# EAGLE design lpcprogger (EAGLE 5.00)
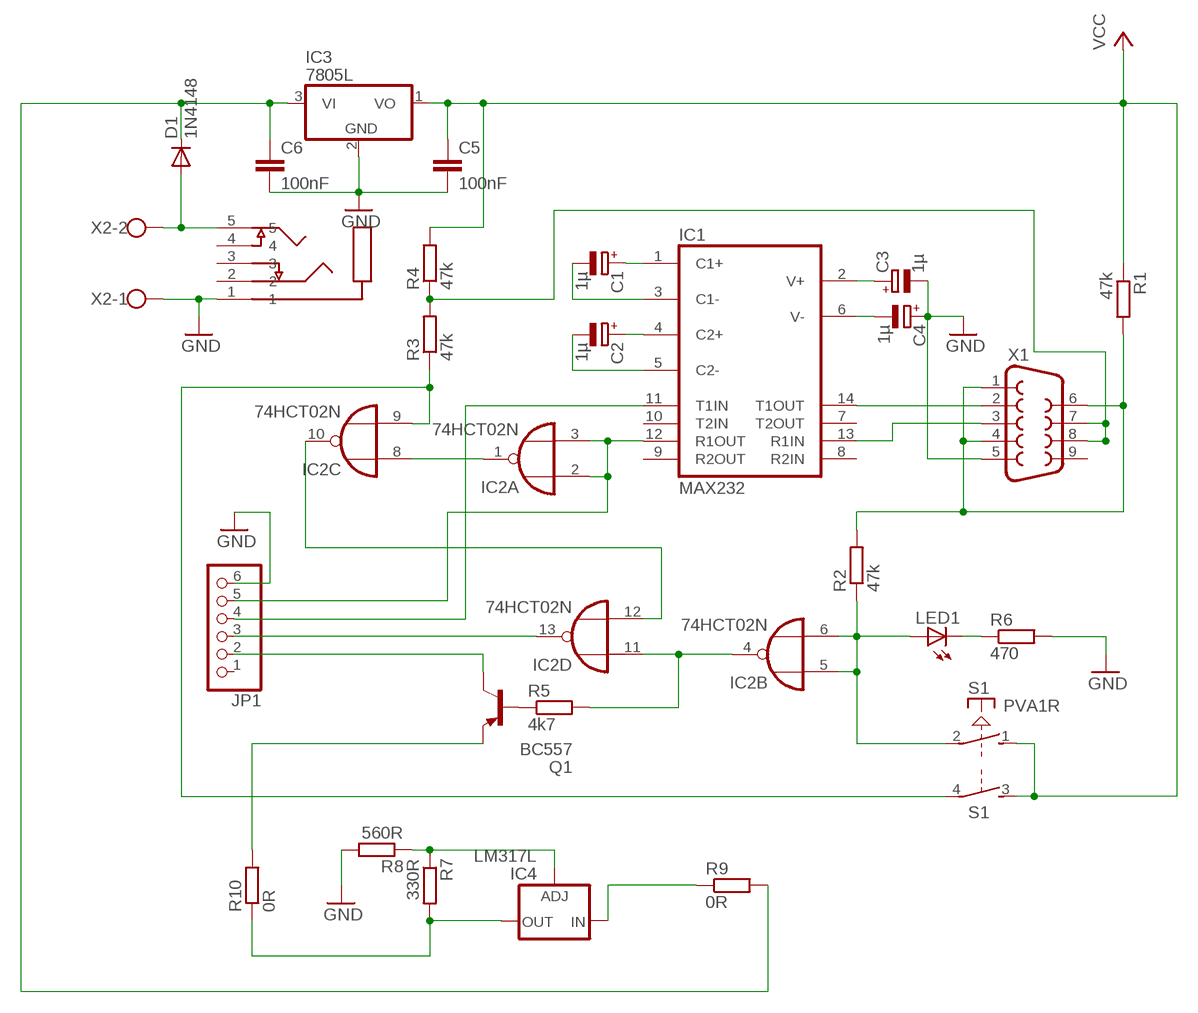
[diagram p0: schematic, sheet 1]

## Parts
C1  1µ  CPOL-EUE2.5-6  [E2,5-6]
C2  1µ  CPOL-EUE2.5-6  [E2,5-6]
C3  1µ  CPOL-EUE2.5-6  [E2,5-6]
C4  1µ  CPOL-EUE2.5-6  [E2,5-6]
C5  100nF  C-EU025-025X050  [C025-025X050]
C6  100nF  C-EU025-025X050  [C025-025X050]
D1  1N4148  [DO35-10]
IC1  MAX232  [DIL16]
IC2  74HCT02N  [DIL14]
IC3  7805L  [TO92]
IC4  LM317L  [317L]
JP1  PINHD-1X6  [1X06]
LED1  LED3MM  [LED3MM]
Q1  BC557  [TO92]
R1  47k  R-EU_0207/10  [0207/10]
R2  47k  R-EU_0207/10  [0207/10]
R3  47k  R-EU_0207/10  [0207/10]
R4  47k  R-EU_0207/10  [0207/10]
R5  4k7  R-EU_0207/10  [0207/10]
R6  470  R-EU_0207/10  [0207/10]
R7  330R  R-EU_0207/7  [0207/7]
R8  560R  R-EU_0207/7  [0207/7]
R9  0R  R-EU_0207/10  [0207/10]
R10  0R  R-EU_0207/10  [0207/10]
S1  PVA1R  [PVA1R]
U$1  KLINKENBUCHSE3,5MMSTEREO  [KLINKE3,5MMSTEREO]
X1  F09H  [F09H]
X2  W237-02P  [W237-132]

## Nets
GND: C3.- C4.+ C5.2 C6.2 IC3.2(GND) JP1.6 R6.2 R8.2 U$1.1 X1.5 X2.1
N$1: Q1.1(E) R10.2
N$2: IC1.14(T1OUT) X1.2
N$3: IC1.13(R1IN) X1.3
N$4: C1.+ IC1.1(C1+)
N$5: C1.- IC1.3(C1-)
N$6: C2.+ IC1.4(C2+)
N$7: C2.- IC1.5(C2-)
N$8: C3.+ IC1.2(V+)
N$9: C4.- IC1.6(V-)
N$11: IC2.5(B:I0) IC2.6(B:I1) LED1.A R2.1 S1.2(1:P)
N$12: IC2.4(B:O) IC2.11(D:I0) R5.2
N$13: IC1.12(R1OUT) IC2.2(A:I0) IC2.3(A:I1) JP1.5
N$14: IC2.1(A:O) IC2.8(C:I0)
N$15: R3.2 R4.1 X1.7 X1.8
N$16: IC2.9(C:I1) R3.1 S1.4(2:P)
N$17: IC2.10(C:O) IC2.12(D:I1)
N$18: IC2.13(D:O) JP1.3
N$19: LED1.K(C) R6.1
N$20: Q1.2(B) R5.1
N$21: IC4.3(IN) R9.1
N$22: JP1.2 Q1.3(C)
N$23: IC1.11(T1IN) JP1.4
N$24: R1.2 R2.2 X1.1 X1.4 X1.6
N$26: IC4.1(ADJ) R7.1 R8.1
N$27: IC4.2(OUT) R7.2 R10.1
N$28: D1.A U$1.5 X2.2
VCC: C5.1 IC3.1(VO) R1.1 R4.2 S1.1(1:S) S1.3(2:S)
VDD: C6.1 D1.C IC3.3(VI) R9.2
Unconnected: IC1.7(T2OUT) IC1.8(R2IN) IC1.9(R2OUT) IC1.10(T2IN) JP1.1 U$1.2 U$1.3 U$1.4 X1.9

## Power pins joined to a net without a drawn wire
GND: IC1.15(GND) IC2.7(P:GND)
VCC: IC1.16(VCC) IC2.14(P:VCC)

## Library data of the parts
C1-C4 = rcl:CPOL-EU: POLARIZED CAPACITOR, European symbol
C5 C6 = rcl:C-EU: CAPACITOR, European symbol
D1 = diode:1N4148: DIODE high speed (Philips)
IC1 = maxim:MAX232: RS232 TRANSEIVER
IC2 = 74xx-eu:74*02: Quad 2-input NOR gate
IC3 = linear:78*: Positive VOLTAGE REGULATOR Source: http://cache.national.com/ds/LM/LM78L05.pdf http://www.fairchildsemi.com/ds/LM/LM7805.pdf
IC4 = v-reg:LM317L: VOLTAGE REGULATOR
JP1 = pinhead:PINHD-1X6: PIN HEADER
LED1 = led:LED: LED OSRAM: - CHIPLED LG R971, LG N971, LY N971, LG Q971, LY Q971, LO R971, LY R971 LH N974, LH R974 LS Q976, LO Q976, LY Q976 LO Q996 - Hyper CHIPLED LW Q18S LB Q993, LB Q99A, LB R99A - SideLED LS A670, LO A670, LY A670, LG A670, LP A670 LB A673, LV A673, LT A673, LW A673 LH A674 LY A675 LS A676, LA A676, LO A676, LY A676, LW A676 LS A679, LY A679, LG A679 - Hyper Micro SIDELED® LS Y876, LA Y876, LO Y876, LY Y876 LT Y87S - SmartLED LW L88C, LW L88S LB L89C, LB L89S, LG L890 LS L89K, LO L89K, LY L89K LS L896, LA L896, LO L896, LY L896 - TOPLED LS T670, LO T670, LY T670, LG T670, LP T670 LSG T670, LSP T670, LSY T670, LOP T670, LYG T670 LG T671, LOG T671, LSG T671 LB T673, LV T673, LT T673, LW T673 LH T674 LS T676, LA T676, LO T676, LY T676, LB T676, LH T676, LSB T676, LW T676 LB T67C, LV T67C, LT T67C, LS T67K, LO T67K, LY T67K, LW E67C LS E67B, LA E67B, LO E67B, LY E67B, LB E67C, LV E67C, LT E67C LW T67C LS T679, LY T679, LG T679 LS T770, LO T770, LY T770, LG T770, LP T770 LB T773, LV T773, LT T773, LW T773 LH T774 LS E675, LA E675, LY E675, LS T675 LS T776, LA T776, LO T776, LY T776, LB T776 LHGB T686 LT T68C, LB T68C - Hyper Mini TOPLED® LB M676 - Mini TOPLED Santana® LG M470 LS M47K, LO M47K, LY M47K Source: http://www.osram.convergy.de - LUMILED® LXK2-PW12-R00, LXK2-PW12-S00, LXK2-PW14-U00, LXK2-PW14-V00 LXK2-PM12-R00, LXK2-PM12-S00, LXK2-PM14-U00 LXK2-PE12-Q00, LXK2-PE12-R00, LXK2-PE12-S00, LXK2-PE14-T00, LXK2-PE14-U00 LXK2-PB12-K00, LXK2-PB12-L00, LXK2-PB12-M00, LXK2-PB14-N00, LXK2-PB14-P00, LXK2-PB14-Q00 LXK2-PR12-L00, LXK2-PR12-M00, LXK2-PR14-Q00, LXK2-PR14-R00 LXK2-PD12-Q00, LXK2-PD12-R00, LXK2-PD12-S00 LXK2-PH12-R00, LXK2-PH12-S00 LXK2-PL12-P00, LXK2-PL12-Q00, LXK2-PL12-R00 Source: www.luxeon.com
Q1 = transistor-pnp:BC557: PNP Transistor
R1-R10 = rcl:R-EU_: RESISTOR, European symbol
S1 = switch-misc:PVA1R: ITT SWITCH
U$1 = kubi:KLINKENBUCHSE3,5MMSTEREO
X1 = con-subd:F09: SUB-D
X2 = con-wago-508:W237-02P: WAGO SREW CLAMP

## Board
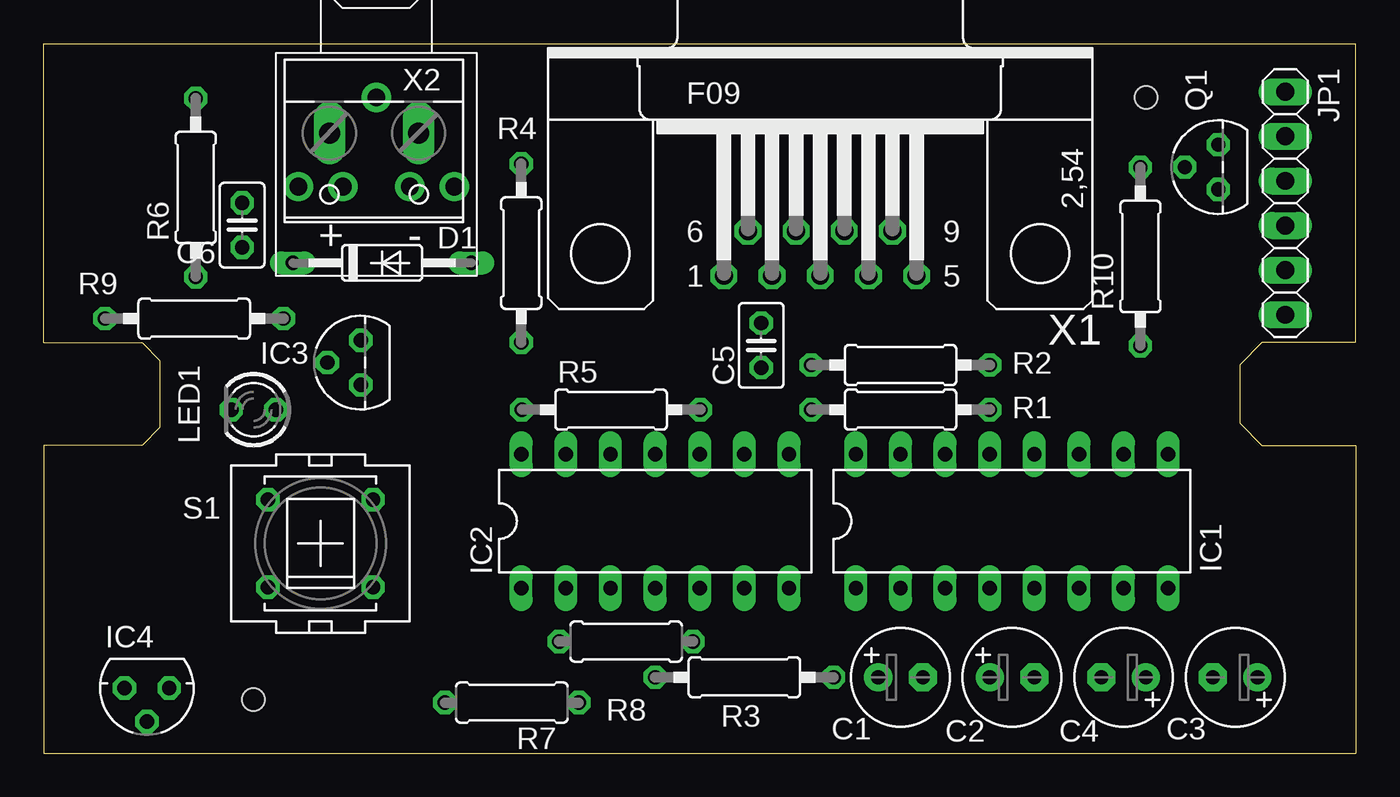
[diagram p1: board, top side]
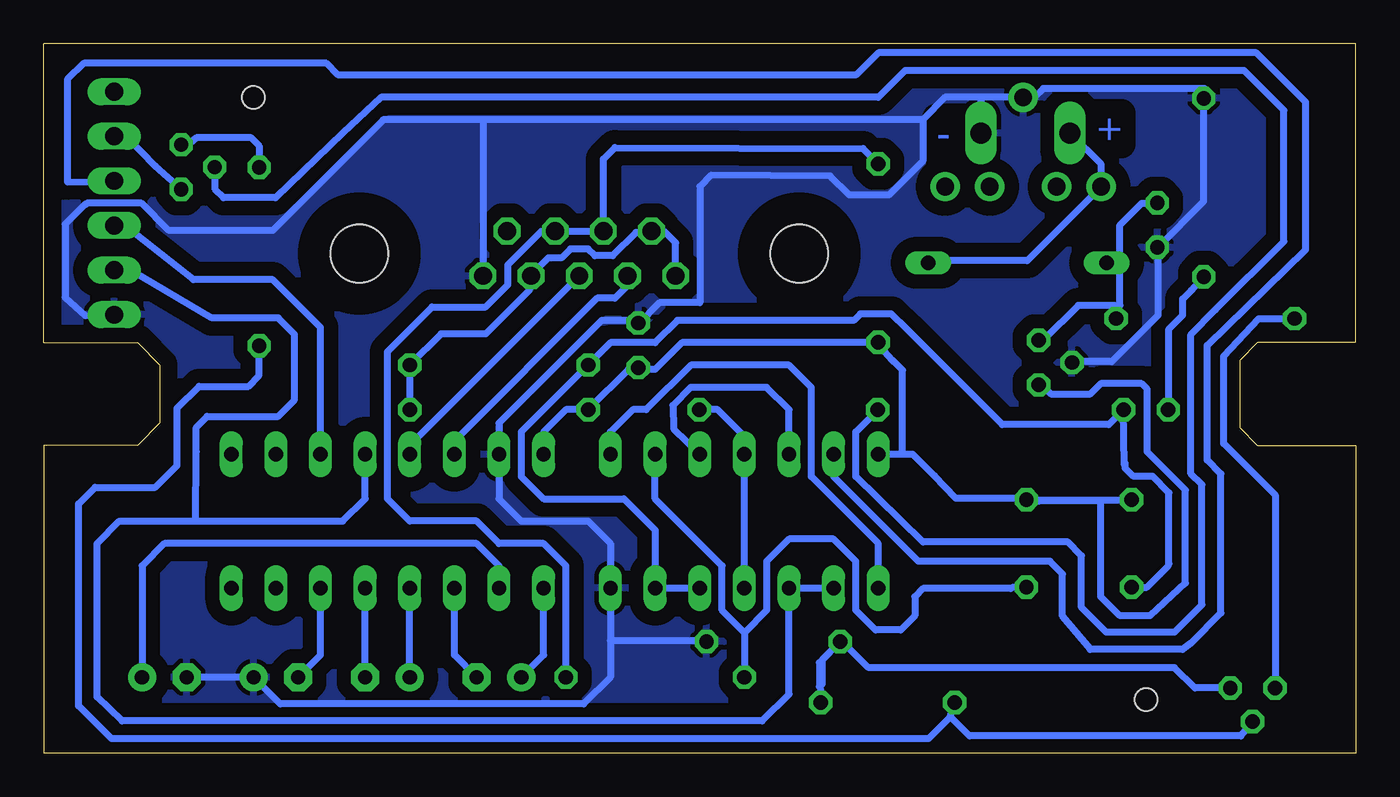
[diagram p2: board, bottom side, seen from below]

Size 74.68 x 40.39 mm. Coordinates in mm from the lower left corner, seen from the top.
Outline: 5.59,23.37 6.6,22.35 6.6,18.54 5.59,17.53 0,17.53 0,0 74.68,0 74.68,17.53 69.34,17.53 68.07,18.8 68.07,22.1 69.34,23.37 74.68,23.37 74.68,40.39 0,40.39 0,23.37 5.59,23.37
Copper layers (1*16): Top 0.035mm / dielectric 1.5mm / Bottom 0.035mm
Design rules "default": minimum track width 10mil, minimum drill 24mil, track to track 8mil, track to pad 8mil, pad to pad 8mil, via to via 8mil, smd to smd 8mil, copper to edge 40mil, drill to drill 8mil, minimum pad ring 10mil, minimum via ring 8mil, stop-mask expansion 4mil, vias tented up to drill 0mil, thermal gap 10mil
Holes 1.3 mm at 62.74,37.34 11.94,3.05

### Footprints (pad centres in the part's own frame; a part is rotated, then mirrored left to right if it is on the bottom)
E2,5-6 = drill 0.813 pad 1.6 round: + -1.27,0 | drill 0.813 pad 1.6 octagon: - 1.27,0
C025-025X050 = drill 0.813 octagon: 1 -1.27,0; 2 1.27,0
DO35-10 = drill 0.813 long: A 5.08,0; C -5.08,0
DIL16 = drill 0.813 long: 1 -8.89,-3.81; 2 -6.35,-3.81; 3 -3.81,-3.81; 4 -1.27,-3.81; 5 1.27,-3.81; 6 3.81,-3.81; 7 6.35,-3.81; 8 8.89,-3.81; 9 8.89,3.81; 10 6.35,3.81; 11 3.81,3.81; 12 1.27,3.81; 13 -1.27,3.81; 14 -3.81,3.81; 15 -6.35,3.81; 16 -8.89,3.81
DIL14 = drill 0.813 long: 1 -7.62,-3.81; 2 -5.08,-3.81; 3 -2.54,-3.81; 4 0,-3.81; 5 2.54,-3.81; 6 5.08,-3.81; 7 7.62,-3.81; 8 7.62,3.81; 9 5.08,3.81; 10 2.54,3.81; 11 0,3.81; 12 -2.54,3.81; 13 -5.08,3.81; 14 -7.62,3.81
TO92 = drill 0.813 octagon: 1 -1.27,0; 2 0,1.905; 3 1.27,0
317L = drill 0.813 octagon: 1 -1.27,0; 2 0,1.905; 3 1.27,0
1X06 = drill 1.016 long: 1 -6.35,0; 2 -3.81,0; 3 -1.27,0; 4 1.27,0; 5 3.81,0; 6 6.35,0
LED3MM = drill 0.813 octagon: A -1.27,0; K 1.27,0
TO92' = drill 0.813 octagon: 1 1.27,0; 2 0,1.905; 3 -1.27,0
0207/10 = drill 0.813 octagon: 1 -5.08,0; 2 5.08,0
0207/7 = drill 0.813 octagon: 1 -3.81,0; 2 3.81,0
PVA1R = drill 0.813 octagon: 1 -2.997,2.489; 2 -2.997,-2.489; 3 2.997,2.489; 4 2.997,-2.489
KLINKE3,5MMSTEREO = drill 1 pad 1.676 round: 1 2.54,5.715; 2 7.62,10.16; 3 7.62,7.62; 4 7.62,3.81; 5 7.62,1.27
F09H = drill 1.016 octagon: 1 -5.486,-1.27; 2 -2.743,-1.27; 3 0,-1.27; 4 2.743,-1.27; 5 5.486,-1.27; 6 -4.115,1.27; 7 -1.372,1.27; 8 1.372,1.27; 9 4.115,1.27 | hole 3.302: -12.522,0; 12.522,0
W237-132 = drill 1.194 long: 1 -2.54,-0.635; 2 2.54,-0.635

### Placement (x,y rotation side)
C1  48.77,4.32 0 top
C2  55.12,4.32 0 top
C3  67.82,4.32 180 top
C4  61.47,4.32 180 top
C5  40.84,23.22 90 top
C6  11.28,30.07 270 top
D1  19.25,27.92 0 top
IC1  55.12,13.21 0 top
IC2  34.8,13.21 0 top
IC3  18.04,22.24 90 top
IC4  5.86,3.71 180 top
JP1  70.67,31.31 270 top
LED1  11.94,19.56 180 top
Q1  BC557  [TO92']  66.86,33.37 90 top
R1  48.77,19.56 0 top
R2  48.77,22.1 0 top
R3  39.88,4.32 0 top
R4  27.18,28.47 270 top
R5  32.29,19.56 0 top
R6  8.65,32.21 90 top
R7  26.64,2.88 180 top
R8  33.15,6.35 0 top
R9  8.56,24.74 0 top
R10  62.42,28.28 90 top
S1  15.75,11.94 0 top
U$1  13.21,39.88 270 top
X1  44.2,28.45 0 top
X2  18.8,34.67 180 top

### Tracks (layer width: path | path; a pad name or v marks a point on that pad's centre or on a via)
GND
  Bottom 0.406: C3.- C4.+ 61.21,2.79 43.94,2.79 42.42,4.32 42.42,6.42 | 42.42,6.42 IC2.7 42.42,11.94 43.69,13.21 47.5,13.21 48.77,14.48 IC1.15 48.77,18.8 42.93,24.64 40.99,24.64 C5.2 40.89,24.43 40.89,24.38 39.62,25.65 37.34,25.65 37.34,32.26 36.69,32.91 29.91,32.87 28.82,31.78 26.57,31.78 24.64,33.71 24.64,36.07 | JP1.6 72.32,24.9 73.46,25.95 73.46,30.11 72.32,31.25 72.28,31.25 72.23,31.31 69.12,31.31 67.56,29.76 61.65,29.76 55.37,36.03 55.37,36.07 49.78,36.07 | 24.64,36.07 49.78,36.07 | 19.56,37.34 18.29,37.34 17.78,37.85 8.6,37.85 8.66,37.6 R6.2 8.64,31.42 11.24,28.82 | 19.56,37.34 U$1.1 | 24.64,36.07 23.37,37.34 21.34,37.34 | 19.56,37.34 21.34,37.34 | X1.5 49.68,35.97 49.78,36.07 | IC3.2 15.63,22.29 13.89,22.29 11.24,24.93 11.24,28.82 | 21.34,37.34 X2.1 | R8.2 37.03,6.42 42.42,6.42 | 11.24,28.82 11.27,28.8 C6.2
  pour Bottom (isolate 0.813): -1.98,42.05 -0.43,43.6 76.12,43.6 77.05,42.67 77.05,-2.45 76.9,-2.29 -1.2,-2.29
N$1
  Bottom 0.406: Q1.1 66.94,34.26 66,35.05 62.87,35.05 62.43,34.58 R10.2 | 62.43,33.33 R10.2 | R10.2
N$2
  Bottom 0.406: IC1.14 51.31,17.78 43.18,25.91 42.16,25.91 41.4,26.67 41.4,27.18 X1.2
N$3
  Bottom 0.406: IC1.13 53.85,17.53 X1.3
N$4
  Bottom 0.406: C1.+ 46.23,5.59 IC1.1
N$5
  Bottom 0.406: C1.- 51.31,5.59 IC1.3
N$6
  Bottom 0.406: C2.+ IC1.4
N$7
  Bottom 0.406: C2.- IC1.5
N$8
  Bottom 0.406: IC1.2 48.77,10.67 50.04,11.94 67.82,11.94 69.09,10.67 C3.+
N$9
  Bottom 0.406: C4.- 58.93,5.59 IC1.6
N$11
  Bottom 0.406: IC2.5 IC2.6 39.88,12.7 41.66,14.48 46.23,14.48 47.5,15.75 47.5,18.29 R2.1 42.42,23.37 39.88,23.37 38.61,24.64 28.57,24.64 28.19,25.02 26.43,25.02 25.56,24.15 | S1.2 11.89,9.45 10.67,10.67 10.62,10.78 10.62,14.82 11.55,15.75 12.64,15.75 13.11,16.22 13.11,16.5 13.16,16.4 LED1.A 14.05,18.71 20.11,18.71 25.56,24.15 | 25.56,24.15
N$12
  Bottom 0.406: IC2.4 IC2.11 34.8,18.03 36.32,19.56 R5.2
N$13
  Bottom 0.406: JP1.5 69.65,27.45 65.12,24.78 61.34,24.78 60.4,23.84 60.4,20.11 61.34,19.18 65.38,19.18 66,18.55 66,17.15 66.04,13.21 | IC2.2 IC2.3 32.26,3.36 33.78,1.83 70.23,1.83 71.65,3.2 71.65,11.94 70.38,13.21 66.04,13.21 | IC1.12 56.39,14.48 57.66,13.21 66.04,13.21
N$14
  Bottom 0.406: IC2.8 42.42,18.29 41.15,19.56 40.39,19.56 37.85,22.1 32.26,22.1 30.99,20.83 30.99,15.75 27.18,11.94 IC2.1
N$15
  Bottom 0.406: R3.2 44.96,10.67 46.23,11.94 48.77,11.94 50.04,13.21 53.85,13.21 55.12,14.48 55.12,22.86 52.58,25.4 49.53,25.4 48.26,26.67 48.26,27.81 46.36,29.72 X1.8 X1.7 42.82,33.83 42.16,34.49 28.04,34.42 R4.1
N$16
  Bottom 0.406: IC2.9 39.88,14.48 36.07,10.67 36.07,8.13 34.8,6.86 | 34.8,6.86 33.53,8.13 33.53,10.92 32.26,12.19 29.72,12.19 28.45,10.92 28.45,8.13 27.33,7.01 25.89,7.01 25.09,7.82 25.09,8.91 24.62,9.38 19.64,9.38 19.51,9.45 S1.4 | 34.8,6.86 R3.1
N$17
  Bottom 0.406: IC2.10 38.82,18.47 38.86,19.8 37.86,20.83 33.53,20.83 32.26,19.56 IC2.12
N$18
  Bottom 0.406: IC2.13 29.72,15.75 24.89,10.92 17.4,10.92 16.68,10.2 16.68,7.79 15.1,5.9 9.85,5.9 9.38,6.26 7.66,7.98 7.67,7.98 7.67,15.91 8.44,16.69 8.44,23.22 2.84,28.67 2.84,37.07 5.65,39.88 27.18,39.88 28.45,38.61 57.91,38.61 58.59,39.28 72.42,39.28 73.34,38.37 73.34,32.53 JP1.3
N$19
  Bottom 0.406: R6.1 9.36,26.35 9.84,25.87 9.84,24.93 10.62,24.15 10.62,19.64 10.67,19.6 LED1.K
N$20
  Bottom 0.406: R5.1 27.18,19.56 28.45,18.29 28.45,15.75 24.62,12.02 16.38,12.02 15.6,11.24 15.6,8.29 14.2,6.89 10.31,6.89 8.75,8.44 8.75,15.29 9.38,15.91 9.38,23.84 7.98,25.24 4.09,29.13 4.09,36.6 6.35,38.86 25.65,38.86 27.18,37.34 55.48,37.34 57.66,35.31 61.49,31.62 64.45,31.62 64.92,32.09 64.92,32.87 Q1.2
N$21
  Bottom 0.406: R9.1 5.52,24.74 7.51,22.6 7.51,17.62 4.55,14.66 4.55,3.77 4.59,3.74 IC4.3
N$22
  Bottom 0.406: Q1.3 68.34,33.43 69.89,35.05 69.78,35.07 JP1.2
N$23
  Bottom 0.406: JP1.4 69.91,29.98 69.89,29.91 66.16,26.96 61.65,26.96 58.93,24.23 IC1.11
N$24
  Bottom 0.406: R1.2 R2.2 52.07,23.88 49.53,23.88 47.04,26.36 47.04,27.38 46.94,27.38 X1.4 46.99,27.18 45.97,28.19 45.21,28.19 44.7,28.7 43.69,28.7 43.31,28.32 42.29,28.32 40.97,29.64 X1.6 | X1.1 38.71,29.06 39.37,29.72 X1.6 | X1.6 40.13,29.72
N$26
  Bottom 0.406: R7.1 30.49,3.93 30.38,3.93 30.38,5.31 R8.1 | R8.1 30.53,5.15 30.53,3.77 | IC4.1 9.15,3.71 10.31,4.86 27.73,4.86 29.29,6.42 29.34,6.37 R8.1
N$27
  Bottom 0.406: R7.2 22.91,2.8 23.07,2.06 | 23.07,2.06 24.31,0.82 70.83,0.82 72.69,2.69 72.69,14.2 71.76,15.13 68.34,15.13 67.09,16.38 67.09,19.64 65.85,20.89 63.02,20.89 62.43,21.51 R10.1 | IC4.2 6.53,0.98 21.98,0.98 23.07,2.06 | 23.07,2.06
N$28
  Bottom 0.406: X2.2 14.48,33.53 U$1.5 18.69,28.04 24.31,28.04 24.31,27.94 D1.A
VCC
  Bottom 0.406: 18.29,14.48 18.34,14.43 S1.3 18.87,14.51 22.75,14.51 23.97,15.79 | S1.1 18.24,14.43 18.29,14.48 | 23.97,15.79 25.2,17.02 25.79,17.02 | 25.79,17.02 IC2.14 | IC1.16 46.23,18.29 44.96,19.56 R1.1 41.4,21.84 40.64,21.84 | 27.27,23.37 27.18,23.37 R4.2 | 27.27,23.37 38.35,23.37 39.88,21.84 40.64,21.84 | 27.27,23.37 27.27,23.38 26.36,22.36 26.29,22.29 25.81,21.82 25.79,21.81 25.79,17.02 | 40.64,21.84 40.89,21.84 40.89,21.89 C5.1 40.73,21.84 40.64,21.84 | 23.97,15.79 | 18.29,14.48 18.01,14.35 14.51,14.35 14.51,14.04 14.51,8.91 13.42,7.82 11.71,7.82 9.69,9.69 9.69,14.98 11.86,17.15 11.86,20.73 12.18,21.04 14.51,21.04 15.13,20.42 17.31,20.42 17.78,20.89 17.96,20.89 IC3.1
VDD
  Bottom 0.406: IC3.3 17.78,23.51 15.79,25.5 13.73,25.5 | R9.2 13.73,25.36 13.73,25.5 | 13.73,25.5 13.42,25.5 13.42,27.89 | 13.42,27.89 13.42,30.07 12.18,31.31 11.26,31.31 | 11.26,31.31 11.24,31.31 | 11.26,31.31 C6.1 | D1.C 13.42,27.92 13.42,27.89

### Text on the board
Bottom: + | -
tPlace: + | -
tValues: GND